# Altium project TpIntegrador.PrjPcb
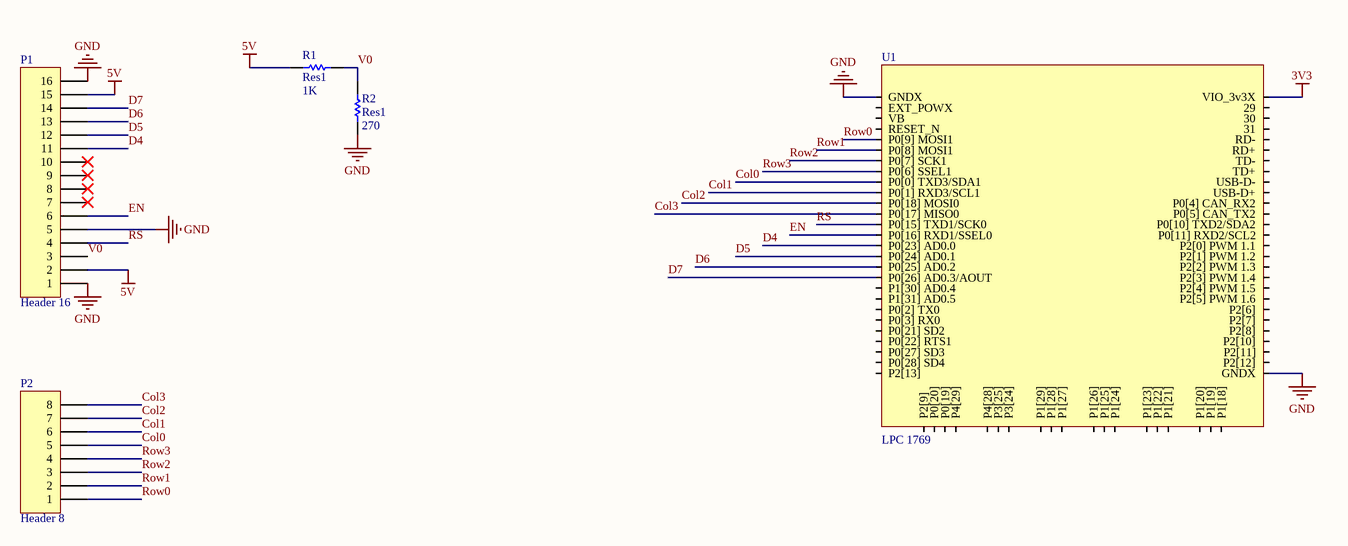
[diagram p0: TpIntegradorSch.SchDoc]
1 sheet, 5 parts. Net scope: global (net labels, ports and power ports of the same name join across sheets).

## Sheet TpIntegradorSch.SchDoc
size A4

### Parts
P1  Header 16  [HDR1X16]
P2  Header 8  [HDR1X8]
R1  Res1  value 1K  [AXIAL-0.3]
R2  Res1  value 270  [AXIAL-0.3]
U1  LPC 1769  [LPC 1769]

### Nets
3V3: U1.28(VIO_3v3X)
5V: P1.2 P1.15 R1.1
GND: P1.1 P1.5 P1.16 R2.1 U1.1(GNDX) U1.54(GNDX)
Col0: P2.5 U1.9(P0[0]_TXD3/SDA1)
Col1: P2.6 U1.10(P0[1]_RXD3/SCL1)
Col2: P2.7 U1.11(P0[18]_MOSI0)
Col3: P2.8 U1.12(P0[17]_MISO0)
D4: P1.11 U1.15(P0[23]_AD0.0)
D5: P1.12 U1.16(P0[24]_AD0.1)
D6: P1.13 U1.17(P0[25]_AD0.2)
D7: P1.14 U1.18(P0[26]_AD0.3/AOUT)
EN: P1.6 U1.14(P0[16]_RXD1/SSEL0)
Row0: P2.1 U1.5(P0[9]_MOSI1)
Row1: P2.2 U1.6(P0[8]_MOSI1)
Row2: P2.3 U1.7(P0[7]_SCK1)
Row3: P2.4 U1.8(P0[6]_SSEL1)
RS: P1.4 U1.13(P0[15]_TXD1/SCK0)
V0: P1.3 R1.2 R2.2

Not connected (* = marked no-connect by the designer): P1 7* 8* 9* 10*; U1 2(EXT_POWX) 3(VB) 4(RESET_N) 19(P1[30]_AD0.4) 20(P1[31]_AD0.5) 21(P0[2]_TX0) 22(P0[3]_RX0) 23(P0[21]_SD2) 24(P0[22]_RTS1) 25(P0[27]_SD3) 26(P0[28]_SD4) 27(P2[13]) 29 30 31 32(RD-) 33(RD+) 34(TD-) 35(TD+) 36(USB-D-) 37(USB-D+) 38(P0[4]_CAN_RX2) 39(P0[5]_CAN_TX2) 40(P0[10]_TXD2/SDA2) 41(P0[11]_RXD2/SCL2) 42(P2[0]_PWM_1.1) 43(P2[1]_PWM_1.2) 44(P2[2]_PWM_1.3) 45(P2[3]_PWM_1.4) 46(P2[4]_PWM_1.5) 47(P2[5]_PWM_1.6) 48(P2[6]) 49(P2[7]) 50(P2[8]) 51(P2[10]) 52(P2[11]) 53(P2[12]) 55(P2[9]) 56(P0[20]) 57(P4[28]) 58(P1[29]) 59(P1[26]) 60(P1[23]) 61(P1[20]) 62(P0[19]) 63(P3[25]) 64(P1[28]) 65(P1[25]) 66(P1[22]) 67(P1[19]) 68(P4[29]) 69(P3[24]) 70(P1[27]) 71(P1[24]) 72(P1[21]) 73(P1[18])

### Library data of the parts
P1 = Header 16: Header, 16-Pin; LatestRevisionDate: 17-Jul-2002; LatestRevisionNote: Re-released for DXP Platform.; Publisher: Altium Limited
P2 = Header 8: Header, 8-Pin; LatestRevisionDate: 17-Jul-2002; LatestRevisionNote: Re-released for DXP Platform.; Publisher: Altium Limited
R1 R2 = Res1: Resistor; Published: 8-Jun-2000; LatestRevisionDate: 17-Jul-2002; LatestRevisionNote: Re-released for DXP Platform.; PackageReference: AXIAL-0.3; Publisher: Altium Limited; PackageDescription: Axial Device, Thru-Hole; 2 Leads; 0.3 in Pin Spacing